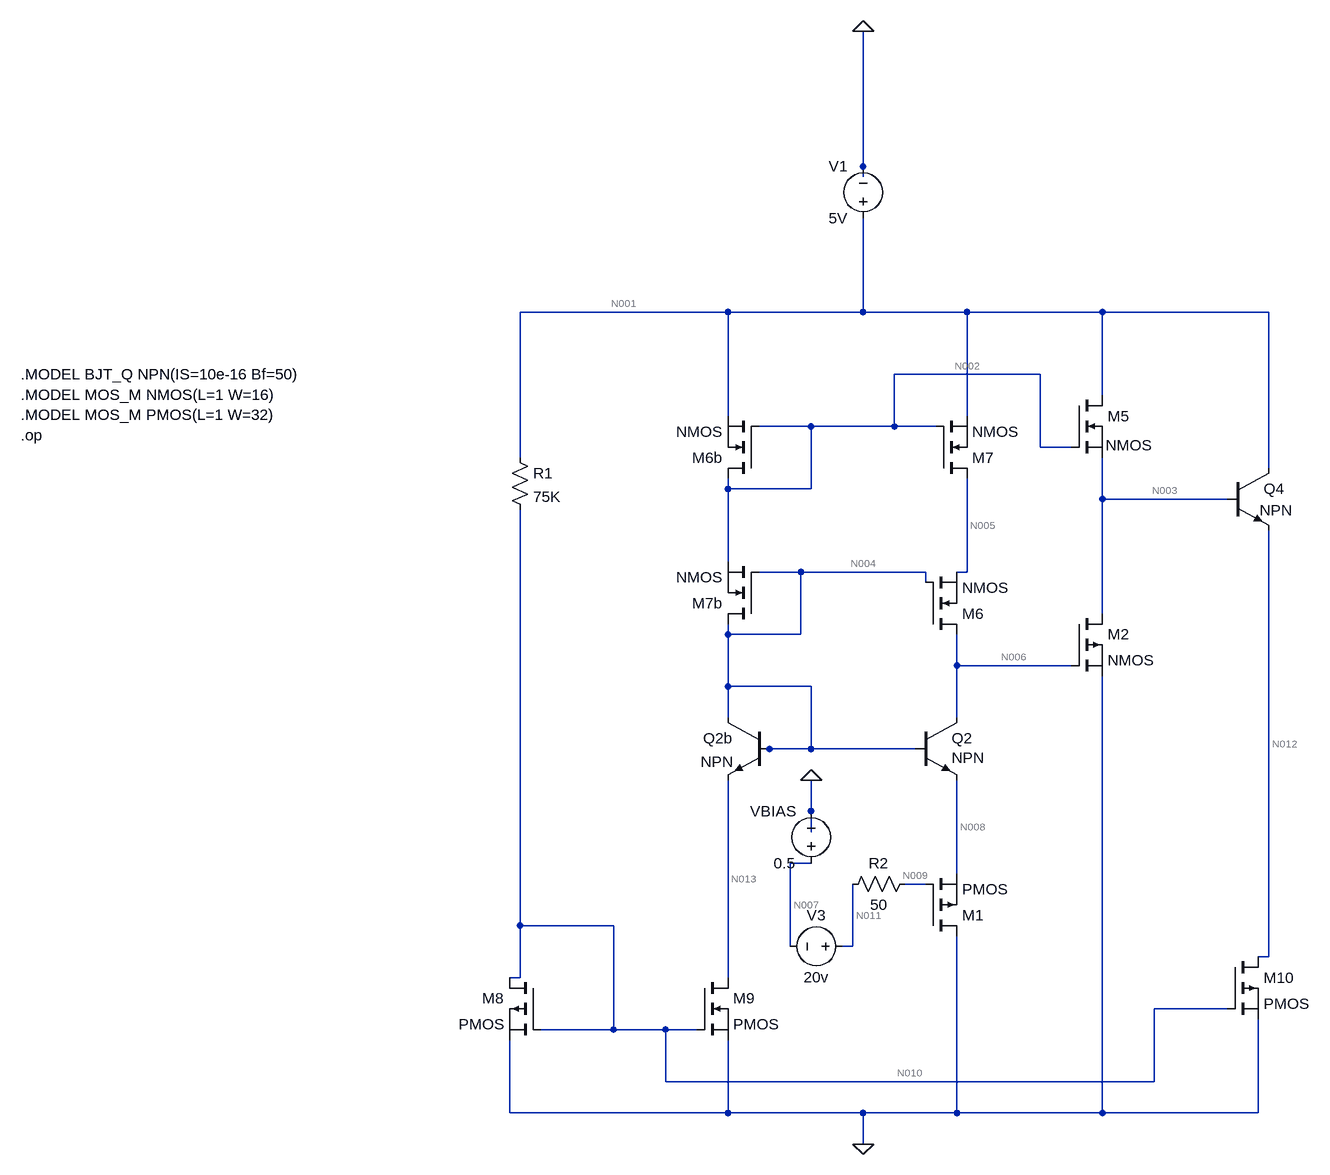
[diagram p0: schematic Yesufu Oluyemisi Faith EEG2016072.asc]
Yesufu Oluyemisi Faith EEG2016072.asc, the LTspice schematic file:
Version 4
SHEET 1 1440 1204
WIRE 432 -320 432 -528
WIRE 432 -304 432 -320
WIRE 224 -96 -96 -96
WIRE 432 -96 432 -240
WIRE 432 -96 224 -96
WIRE 592 -96 432 -96
WIRE 800 -96 592 -96
WIRE 1056 -96 800 -96
WIRE 704 0 480 0
WIRE 800 32 800 -96
WIRE 224 64 224 -96
WIRE 592 64 592 -96
WIRE 352 80 272 80
WIRE 480 80 480 0
WIRE 480 80 352 80
WIRE 544 80 480 80
WIRE 704 112 704 0
WIRE 752 112 704 112
WIRE -96 128 -96 -96
WIRE 1056 144 1056 -96
WIRE 224 176 224 160
WIRE 352 176 352 80
WIRE 352 176 224 176
WIRE 800 192 800 128
WIRE 992 192 800 192
WIRE 224 288 224 176
WIRE 336 304 272 304
WIRE 528 304 336 304
WIRE 592 304 592 160
WIRE 592 304 576 304
WIRE 528 320 528 304
WIRE 800 368 800 192
WIRE 224 400 224 384
WIRE 336 400 336 304
WIRE 336 400 224 400
WIRE 576 448 576 400
WIRE 752 448 576 448
WIRE 224 480 224 400
WIRE 352 480 224 480
WIRE 224 528 224 480
WIRE 576 528 576 448
WIRE 288 576 272 576
WIRE 352 576 352 480
WIRE 352 576 288 576
WIRE 512 576 352 576
WIRE 352 672 352 624
WIRE 352 704 352 672
WIRE 352 752 320 752
WIRE 576 768 576 624
WIRE 528 784 496 784
WIRE -96 848 -96 208
WIRE 48 848 -96 848
WIRE 320 880 320 752
WIRE 416 880 416 784
WIRE 416 880 400 880
WIRE 1056 896 1056 240
WIRE 1056 896 1040 896
WIRE -96 928 -96 848
WIRE -96 928 -112 928
WIRE 224 928 224 624
WIRE 992 976 880 976
WIRE 48 1008 48 848
WIRE 48 1008 -64 1008
WIRE 128 1008 48 1008
WIRE 176 1008 128 1008
WIRE 128 1088 128 1008
WIRE 880 1088 880 976
WIRE 880 1088 128 1088
WIRE -112 1136 -112 1024
WIRE 224 1136 224 1024
WIRE 224 1136 -112 1136
WIRE 432 1136 224 1136
WIRE 576 1136 576 864
WIRE 576 1136 432 1136
WIRE 800 1136 800 464
WIRE 800 1136 576 1136
WIRE 1040 1136 1040 992
WIRE 1040 1136 800 1136
WIRE 432 1184 432 1136
FLAG 432 -528 0
FLAG 432 1184 0
FLAG 352 624 0
SYMBOL nmos 272 160 R180
SYMATTR InstName M6b
SYMBOL nmos 272 384 R180
SYMATTR InstName M7b
SYMBOL nmos 528 400 M180
SYMATTR InstName M6
SYMBOL nmos 544 160 M180
SYMATTR InstName M7
SYMBOL nmos 752 32 R0
WINDOW 3 53 77 Left 2
SYMATTR InstName M5
SYMBOL pmos -64 928 M0
SYMATTR InstName M8
SYMBOL pmos 528 864 M180
SYMATTR InstName M1
SYMBOL pmos 752 368 R0
SYMATTR InstName M2
SYMATTR Value NMOS
SYMBOL pmos 992 896 R0
SYMATTR InstName M10
SYMBOL nmos 176 928 R0
SYMATTR InstName M9
SYMATTR Value PMOS
SYMBOL voltage 432 -224 R180
WINDOW 0 24 96 Left 2
WINDOW 3 24 16 Left 2
WINDOW 123 0 0 Left 2
WINDOW 39 0 0 Left 2
SYMATTR InstName V1
SYMATTR Value 5V
SYMBOL npn 288 528 M0
SYMATTR InstName Q2b
SYMBOL npn 512 528 R0
WINDOW 3 56 62 Left 2
SYMATTR InstName Q2
SYMBOL npn 992 144 R0
WINDOW 3 50 65 Left 2
SYMATTR InstName Q4
SYMBOL res -112 112 R0
SYMATTR InstName R1
SYMATTR Value 75K
SYMBOL res 512 768 R90
WINDOW 0 0 56 VBottom 2
WINDOW 3 32 56 VTop 2
SYMATTR InstName R2
SYMATTR Value 50
SYMBOL voltage 352 768 R180
WINDOW 0 24 96 Left 2
WINDOW 3 24 16 Left 2
WINDOW 123 0 0 Left 2
WINDOW 39 0 0 Left 2
SYMATTR InstName VBIAS
SYMATTR Value 0.5
SYMBOL voltage 416 880 R90
WINDOW 0 -32 56 VBottom 2
WINDOW 3 32 56 VTop 2
WINDOW 123 0 0 Left 2
WINDOW 39 0 0 Left 2
SYMATTR InstName V3
SYMATTR Value 20v
TEXT -864 0 Left 2 !.MODEL BJT_Q NPN(IS=10e-16 Bf=50)\n.MODEL MOS_M NMOS(L=1 W=16)\n.MODEL MOS_M PMOS(L=1 W=32)\n.op

The netlist it stands for:
* Yesufu Oluyemisi Faith EEG2016072.asc
M6b N002 N002 N001 N001 NMOS
M7b N004 N004 N002 N002 NMOS
M6 N006 N004 N005 N005 NMOS
M7 N005 N002 N001 N001 NMOS
M5 N001 N002 N003 N003 NMOS
M8 N010 N010 0 0 PMOS
M1 0 N009 N008 N008 PMOS
M2 N003 N006 0 0 NMOS
M10 N012 N010 0 0 PMOS
M9 N013 N010 0 0 PMOS
V1 N001 0 5V
Q2b N004 N004 N013 0 NPN
Q2 N006 N004 N008 0 NPN
Q4 N001 N003 N012 0 NPN
R1 N001 N010 75K
R2 N009 N011 50
VBIAS N007 0 0.5
V3 N011 N007 20v
.model NPN NPN
.model PNP PNP
.lib standard.bjt
.model NMOS NMOS
.model PMOS PMOS
.lib standard.mos
.MODEL BJT_Q NPN(IS=10e-16 Bf=50)
.MODEL MOS_M NMOS(L=1 W=16)
.MODEL MOS_M PMOS(L=1 W=32)
.op
.backanno
.end

* Results of the author's LTspice run, read from the files saved beside the schematic
* Operating Point:
*   V(n002) = 3.78 V
*   V(n001) = 5 V
*   V(n004) = 2.559 V
*   V(n006) = 4.669 V
*   V(n005) = 4.834 V
*   V(n003) = 953 mV
*   V(n010) = 581.9 mV
*   V(n009) = 20.5 V
*   V(n008) = 2.284 V
*   V(n012) = 417.1 mV
*   V(n013) = 1.22 V
*   V(n011) = 20.5 V
*   V(n007) = 500 mV
*   Ic(Q4) = 99.71 nA
*   Ib(Q4) = 993.5 pA
*   Ie(Q4) = -100.7 nA
*   Ic(Q2) = 6.368 pA
*   Ib(Q2) = -1.791 pA
*   Ie(Q2) = -4.577 pA
*   Ic(Q2b) = 3.057 MA
*   Ib(Q2b) = 30.57 kA
*   Ie(Q2b) = -3.088 MA
*   Id(M9) = 3.088 MA
*   Ig(M9) = 0 A
*   Ib(M9) = -3.088 MA
*   Is(M9) = -4.075 µA
*   Id(M10) = 100.7 nA
*   Ig(M10) = 0 A
*   Ib(M10) = -100.7 nA
*   Is(M10) = -417.1 fA
*   Id(M1) = -4.577 pA
*   Ig(M1) = 0 A
*   Ib(M1) = 2.294 pA
*   Is(M1) = 2.284 pA
*   Id(M8) = 58.91 µA
*   Ig(M8) = 0 A
*   Ib(M8) = -58.91 µA
*   Is(M8) = -581.9 fA
*   Id(M2) = 79.9 µA
*   Ig(M2) = 0 A
*   Ib(M2) = -963 fA
*   Is(M2) = -79.9 µA
*   Id(M5) = 79.9 µA
*   Ig(M5) = 0 A
*   Ib(M5) = -4.057 pA
*   Is(M5) = -79.9 µA
*   Id(M7) = -6.386 pA
*   Ig(M7) = 0 A
*   Ib(M7) = 6.22 pA
*   Is(M7) = 165.7 fA
*   Id(M6) = -6.368 pA
*   Ig(M6) = 0 A
*   Ib(M6) = 6.203 pA
*   Is(M6) = 165.7 fA
*   Id(M7b) = -3.088 MA
*   Ig(M7b) = 0 A
*   Ib(M7b) = 3.088 MA
*   Is(M7b) = 0 A
*   Id(M6b) = -3.088 MA
*   Ig(M6b) = 0 A
*   Ib(M6b) = 3.088 MA
*   Is(M6b) = 0 A
*   I(R2) = 0 A
*   I(R1) = 58.91 µA
*   I(V3) = 0 A
*   I(Vbias) = 0 A
*   I(V1) = -3.088 MA
* From the log:
*   Semiconductor Device Operating Points:
*                           --- Bipolar Transistors ---
*   Name:       q4          q2          q2b
*   Model:      npn         npn         npn
*   Ib:       9.94e-10   -1.79e-12    3.06e+04
*   Ic:       9.97e-08    6.37e-12    3.06e+06
*   Vbe:      5.36e-01    2.76e-01    1.34e+00
*   Vbc:     -4.05e+00   -2.11e+00    0.00e+00
*   Vce:      4.58e+00    2.38e+00    1.34e+00
*   BetaDC:   1.00e+02   -3.56e+00    1.00e+02
*   Gm:       3.85e-06    1.65e-10    1.18e+08
*   Rpi:      2.59e+07    3.78e+11    8.46e-07
*   Rx:       0.00e+00    0.00e+00    0.00e+00
*   Ro:       2.32e+82    6.72e+49    2.59e+14
*   Cbe:      0.00e+00    0.00e+00    0.00e+00
*   Cbc:      0.00e+00    0.00e+00    0.00e+00
*   Cjs:      0.00e+00    0.00e+00    0.00e+00
*   BetaAC:   1.00e+02    6.22e+01    1.00e+02
*   Cbx:      0.00e+00    0.00e+00    0.00e+00
*   Ft:       0.00e+00    0.00e+00    0.00e+00
*                           --- MOSFET Transistors ---
*   Name:          m9          m10         m1          m8          m2
*   Model:        pmos        pmos        pmos        pmos        nmos
*   Id:          3.09e+06    1.01e-07   -4.58e-12    5.89e-05    7.99e-05
*   Vgs:         5.82e-01    5.82e-01    1.82e+01    5.82e-01    4.67e+00
*   Vds:         1.22e+00    4.17e-01   -2.28e+00    5.82e-01    9.53e-01
*   Vbs:         0.00e+00    0.00e+00    0.00e+00    0.00e+00    0.00e+00
*   Vth:        -0.00e+00   -0.00e+00   -0.00e+00   -0.00e+00    0.00e+00
*   Vdsat:      -6.38e-01   -0.00e+00   -0.00e+00   -0.00e+00    4.67e+00
*   Gm:          1.28e-05    0.00e+00    0.00e+00    0.00e+00    1.91e-05
*   Gds:         0.00e+00    0.00e+00    0.00e+00    0.00e+00    7.43e-05
*   Gmb:         0.00e+00    0.00e+00    0.00e+00    0.00e+00    0.00e+00
*   Cbd:         0.00e+00    0.00e+00    0.00e+00    0.00e+00    0.00e+00
*   Cbs:         0.00e+00    0.00e+00    0.00e+00    0.00e+00    0.00e+00
*   Cgsov:       0.00e+00    0.00e+00    0.00e+00    0.00e+00    0.00e+00
*   Cgdov:       0.00e+00    0.00e+00    0.00e+00    0.00e+00    0.00e+00
*   Cgbov:       0.00e+00    0.00e+00    0.00e+00    0.00e+00    0.00e+00
*   Cgs:         0.00e+00    0.00e+00    0.00e+00    0.00e+00    0.00e+00
*   Cgd:         0.00e+00    0.00e+00    0.00e+00    0.00e+00    0.00e+00
*   Cgb:         0.00e+00    0.00e+00    0.00e+00   -0.00e+00    0.00e+00
*   Name:          m5          m7          m6          m7b         m6b
*   Model:        nmos        nmos        nmos        nmos        nmos
*   Id:          7.99e-05   -6.39e-12   -6.37e-12   -3.09e+06   -3.09e+06
*   Vgs:         2.83e+00   -1.22e+00   -2.27e+00   -1.22e+00   -1.22e+00
*   Vds:         4.05e+00   -1.66e-01   -1.66e-01   -1.22e+00   -1.22e+00
*   Vbs:         0.00e+00    0.00e+00    0.00e+00    0.00e+00    0.00e+00
*   Vth:         0.00e+00    0.00e+00    0.00e+00    0.00e+00    0.00e+00
*   Vdsat:       2.83e+00    0.00e+00    0.00e+00    0.00e+00    0.00e+00
*   Gm:          5.65e-05    0.00e+00    0.00e+00    0.00e+00    0.00e+00
*   Gds:         0.00e+00    0.00e+00    0.00e+00    0.00e+00    0.00e+00
*   Gmb:         0.00e+00    0.00e+00    0.00e+00    0.00e+00    0.00e+00
*   Cbd:         0.00e+00    0.00e+00    0.00e+00    0.00e+00    0.00e+00
*   Cbs:         0.00e+00    0.00e+00    0.00e+00    0.00e+00    0.00e+00
*   Cgsov:       0.00e+00    0.00e+00    0.00e+00    0.00e+00    0.00e+00
*   Cgdov:       0.00e+00    0.00e+00    0.00e+00    0.00e+00    0.00e+00
*   Cgbov:       0.00e+00    0.00e+00    0.00e+00    0.00e+00    0.00e+00
*   Cgs:         0.00e+00    0.00e+00    0.00e+00    0.00e+00    0.00e+00
*   Cgd:         0.00e+00    0.00e+00    0.00e+00    0.00e+00    0.00e+00
*   Cgb:         0.00e+00    0.00e+00    0.00e+00   -0.00e+00   -0.00e+00